# EasyEDA schematic SCH_Photon-Avatar-Headset_2024-04-25.json
TITLE: Headset; REV: 1.0; Date: 2024-Feb-26; Sheet: 1/1; Drawn By: Ганболд Энхболд; Company: Digital-People
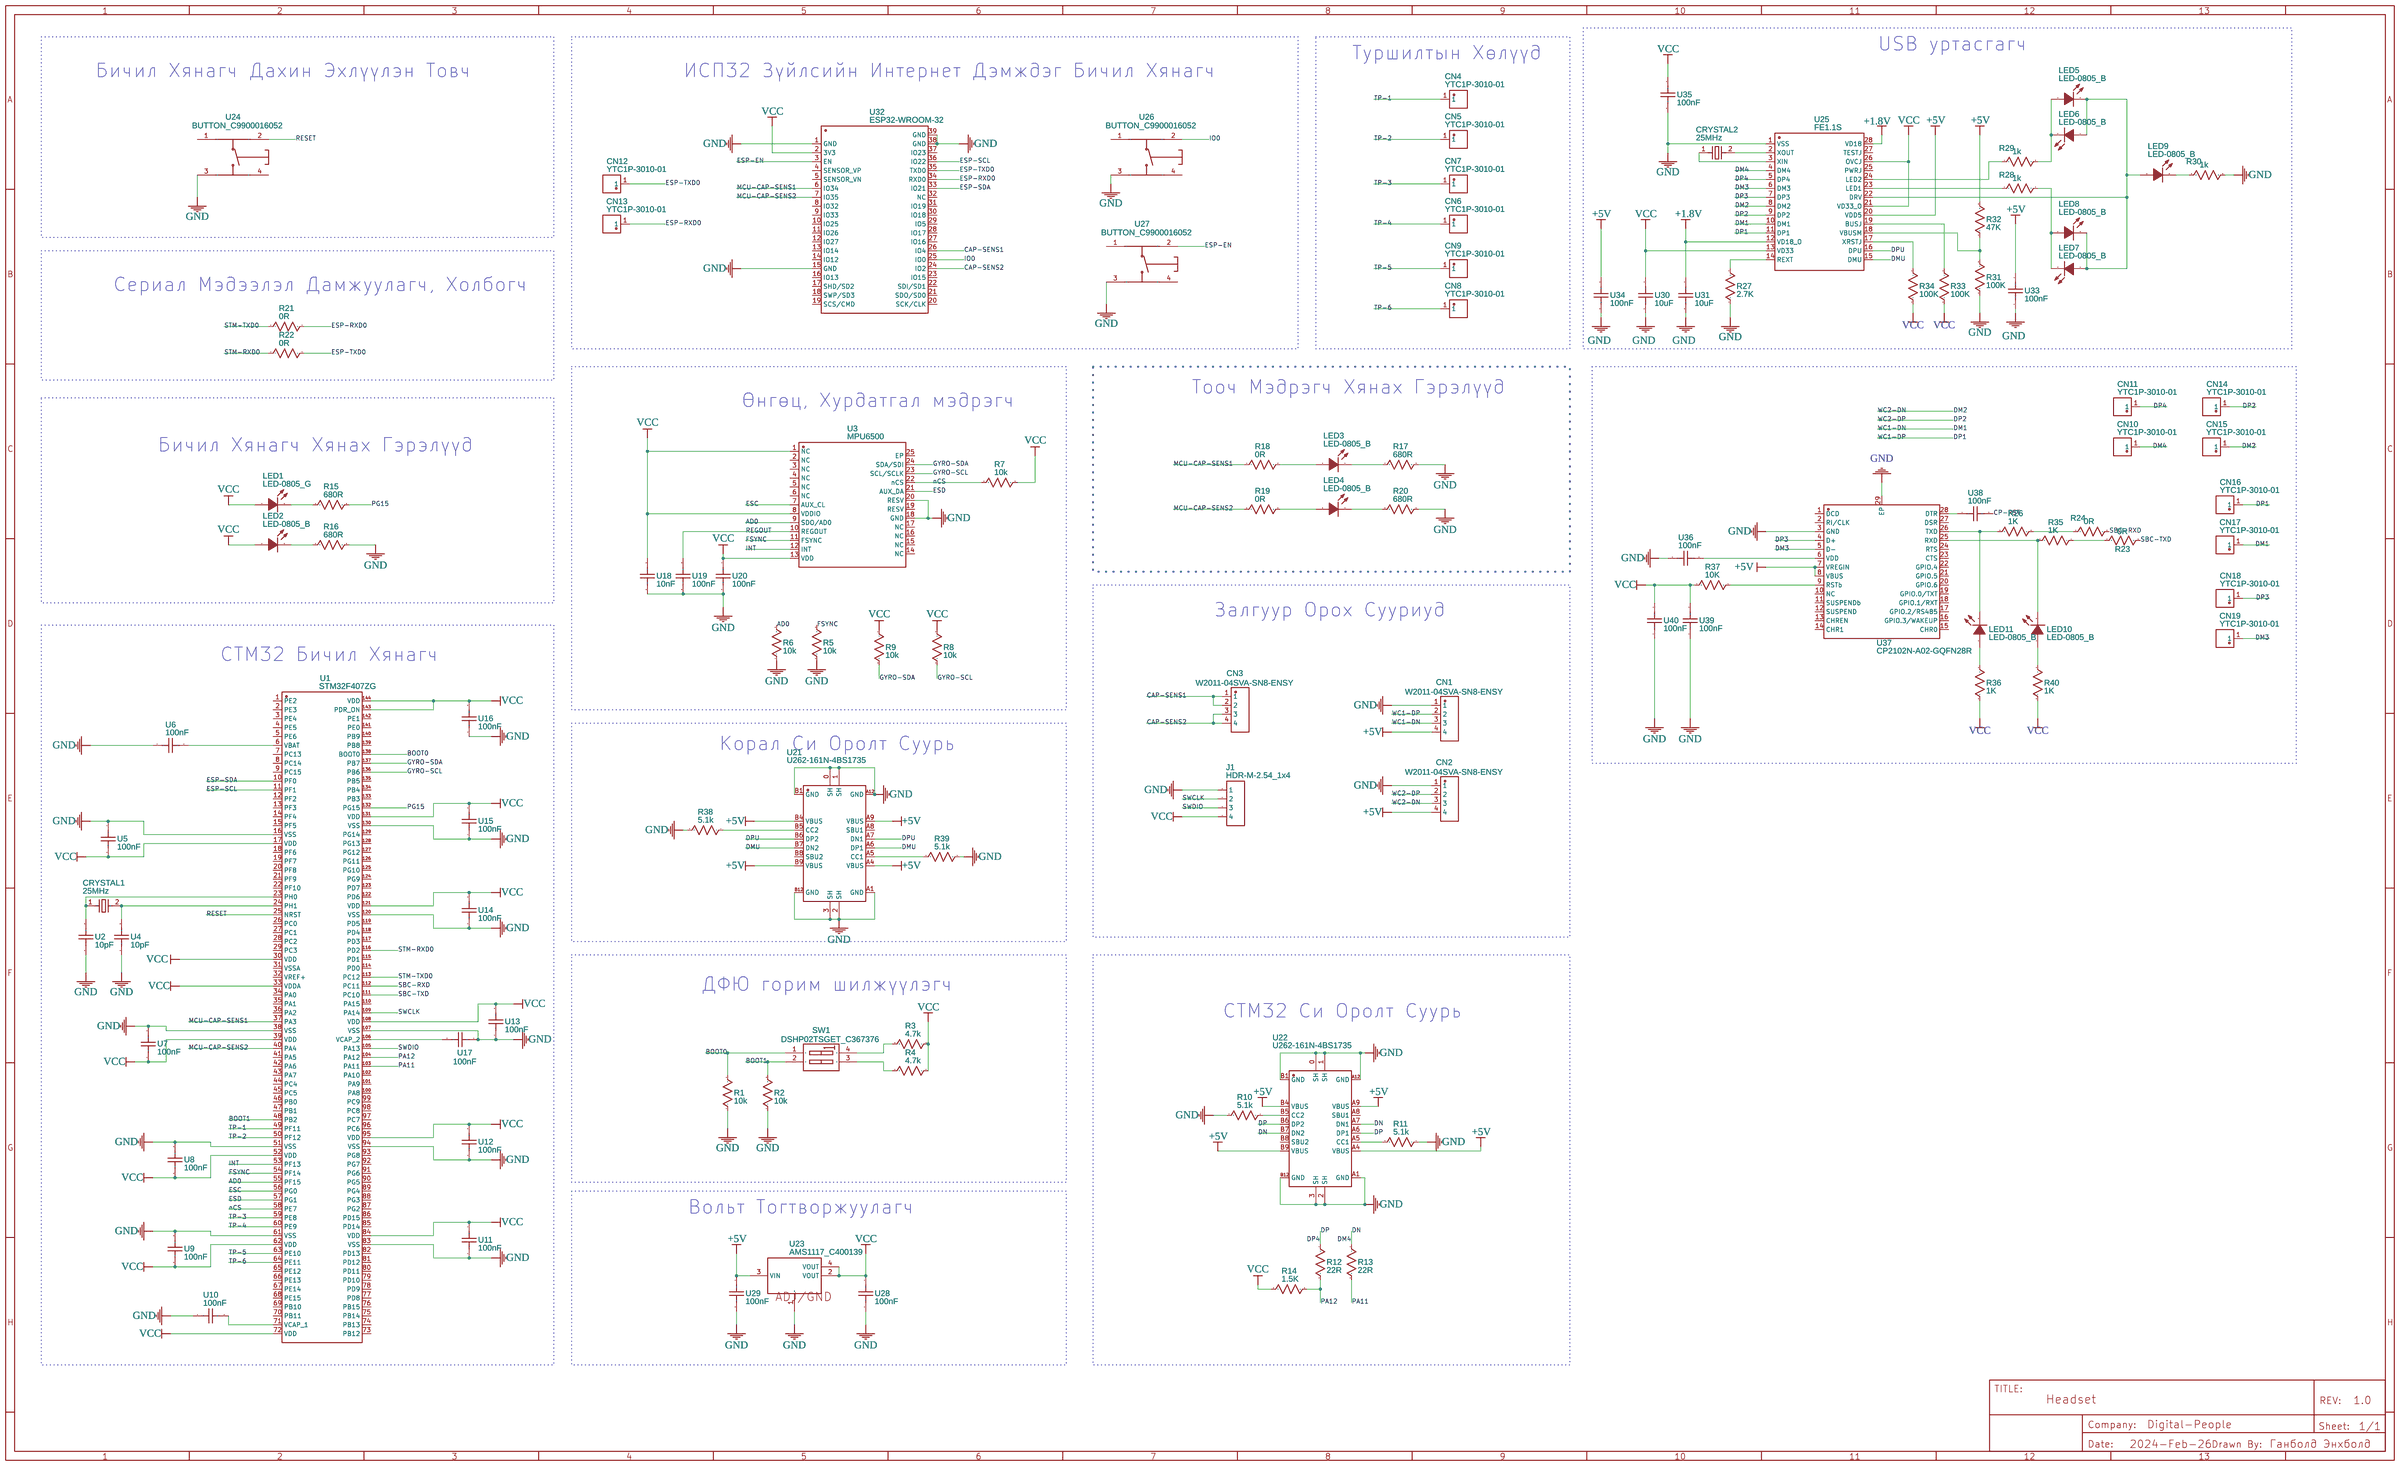
[diagram p0: schematic sheet]

## Parts
CN1  W2011-04SVA-SN8-ENSY  [CONN-TH-4P-P2.00_W2011-04SVA-SN8-ENSY]
CN2  W2011-04SVA-SN8-ENSY  [CONN-TH-4P-P2.00_W2011-04SVA-SN8-ENSY]
CN3  W2011-04SVA-SN8-ENSY  [CONN-TH-4P-P2.00_W2011-04SVA-SN8-ENSY]
CN4  YTC1P-3010-01  [TESTPOINT-SMD_BD2.0_C9900030651]
CN5  YTC1P-3010-01  [TESTPOINT-SMD_BD2.0_C9900030651]
CN6  YTC1P-3010-01  [TESTPOINT-SMD_BD2.0_C9900030651]
CN7  YTC1P-3010-01  [TESTPOINT-SMD_BD2.0_C9900030651]
CN8  YTC1P-3010-01  [TESTPOINT-SMD_BD2.0_C9900030651]
CN9  YTC1P-3010-01  [TESTPOINT-SMD_BD2.0_C9900030651]
CN10  YTC1P-3010-01  [TESTPOINT-SMD_BD2.0_C9900030651]
CN11  YTC1P-3010-01  [TESTPOINT-SMD_BD2.0_C9900030651]
CN12  YTC1P-3010-01  [TESTPOINT-SMD_BD2.0_C9900030651]
CN13  YTC1P-3010-01  [TESTPOINT-SMD_BD2.0_C9900030651]
CN14  YTC1P-3010-01  [TESTPOINT-SMD_BD2.0_C9900030651]
CN15  YTC1P-3010-01  [TESTPOINT-SMD_BD2.0_C9900030651]
CN16  YTC1P-3010-01  [TESTPOINT-SMD_BD2.0_C9900030651]
CN17  YTC1P-3010-01  [TESTPOINT-SMD_BD2.0_C9900030651]
CN18  YTC1P-3010-01  [TESTPOINT-SMD_BD2.0_C9900030651]
CN19  YTC1P-3010-01  [TESTPOINT-SMD_BD2.0_C9900030651]
CRYSTAL1  25MHz  [CRYSTAL-SMD_L11.4-W4.8-LS12.7]
CRYSTAL2  25MHz  [CRYSTAL-SMD_L11.4-W4.8-LS12.7]
J1  HDR-M-2.54_1x4  [HDR-M-2.54_1X4]
LED1  LED-0805_G  [LED0805_GREEN]
LED2  LED-0805_B  [LED0805_BLUE]
LED3  LED-0805_B  [LED0805_BLUE]
LED4  LED-0805_B  [LED0805_BLUE]
LED5  LED-0805_B  [LED0805_BLUE]
LED6  LED-0805_B  [LED0805_BLUE]
LED7  LED-0805_B  [LED0805_BLUE]
LED8  LED-0805_B  [LED0805_BLUE]
LED9  LED-0805_B  [LED0805_BLUE]
LED10  LED-0805_B  [LED0805_BLUE]
LED11  LED-0805_B  [LED0805_BLUE]
R1  10k  [R0805]
R2  10k  [R0805]
R3  4.7k  [R0805]
R4  4.7k  [R0805]
R5  10k  [R0805]
R6  10k  [R0805]
R7  10k  [R0805]
R8  10k  [R0805]
R9  10k  [R0805]
R10  5.1k  [R0805]
R11  5.1k  [R0805]
R12  22R  [R0805]
R13  22R  [R0805]
R14  1.5K  [R0805]
R15  680R  [R0805]
R16  680R  [R0805]
R17  680R  [R0805]
R18  0R  [R0603]
R19  0R  [R0603]
R20  680R  [R0805]
R21  0R  [R0603]
R22  0R  [R0603]
R23  0R  [R0603]
R24  0R  [R0603]
R26  1K  [R0805]
R27  2.7K  [R0805]
R28  1k  [R0805]
R29  1k  [R0805]
R30  1k  [R0805]
R31  100K  [R0805]
R32  47K  [R0805]
R33  100K  [R0805]
R34  100K  [R0805]
R35  1K  [R0805]
R36  1K  [R0805]
R37  10K  [R0805]
R38  5.1k  [R0805]
R39  5.1k  [R0805]
R40  1K  [R0805]
SW1  DSHP02TSGET_C367376  [SW-SMD_DSHP02TSGER]
U1  STM32F407ZG  [QFP-144_L20.0-W20.0-P0.50-LS22.0-BL]
U2  10pF  [C0805]
U3  MPU6500  [QFN-24_L3.0-W3.0-P0.40-BL-EP]
U4  10pF  [C0805]
U5  100nF  [C0805]
U6  100nF  [C0805]
U7  100nF  [C0805]
U8  100nF  [C0805]
U9  100nF  [C0805]
U10  100nF  [C0805]
U11  100nF  [C0805]
U12  100nF  [C0805]
U13  100nF  [C0805]
U14  100nF  [C0805]
U15  100nF  [C0805]
U16  100nF  [C0805]
U17  100nF  [C0805]
U18  10nF  [C0805]
U19  100nF  [C0805]
U20  100nF  [C0805]
U21  U262-161N-4BS1735  [USB-C-SMD_TYPE-C-16P-4BS1735]
U22  U262-161N-4BS1735  [USB-C-SMD_TYPE-C-16P-4BS1735]
U23  AMS1117_C400139  [SOT-223-3_L6.5-W3.4-P2.30-LS7.0-BR]
U24  BUTTON_C9900016052  [SW-SMD_4P-L5.1-W5.1-P3.70-LS6.5-TL-2]
U25  FE1.1S  [SSOP-28_L9.9-W3.9-P0.64-LS6.0-BL-1]
U26  BUTTON_C9900016052  [SW-SMD_4P-L5.1-W5.1-P3.70-LS6.5-TL-2]
U27  BUTTON_C9900016052  [SW-SMD_4P-L5.1-W5.1-P3.70-LS6.5-TL-2]
U28  100nF  [C0805]
U29  100nF  [C0805]
U30  10uF  [C0805]
U31  10uF  [C0805]
U32  ESP32-WROOM-32  [WIFIM-SMD_ESP32-WROOM-32-N4]
U33  100nF  [C0805]
U34  100nF  [C0805]
U35  100nF  [C0805]
U36  100nF  [C0805]
U37  CP2102N-A02-GQFN28R  [QFN-28_L5.0-W5.0-P0.50-TL-EP3.3]
U38  100nF  [C0805]
U39  100nF  [C0805]
U40  100nF  [C0805]

## Library data of the parts
CN1-CN3 = W2011-04SVA-SN8-ENSY: Contributor: lcsc; Supplier: LCSC; Supplier Part: C9900022692; Manufacturer: null
CN4-CN19 = YTC1P-3010-01: Supplier: LCSC; Supplier Part: C5221282; Manufacturer: YIYUAN(怡远); JLCPCB Part Class: Extended Part; Contributor: lcsc
CRYSTAL1 CRYSTAL2 = SD2012M00020001: Supplier: LCSC; Supplier Part: C7294737; Manufacturer: HUAXIN(华昕); Contributor: lcsc
J1 = HDR-M-2.54_1x4: Supplier Part: C124378; Supplier: LCSC; Contributor: LCEDA_Lib
LED1 = LED-0805_G: Manufacturer: 国星光电; Manufacturer Part: NCD0805G1; Supplier Part: C84260; Contributor: LCEDA_Lib
LED2-LED11 = LED-0805_B: Manufacturer: 方舟 ARKLED; Manufacturer Part: D-B080508B1-KS2; Supplier Part: C108412; Contributor: LCEDA_Lib
R1-R24 R26-R40 = R_0805_US: Contributor: LCEDA_Lib
SW1 = DSHP02TSGET_C367376: Contributor: LCSC; Supplier: LCSC; Supplier Part: C367376; Manufacturer: YE; Manufacturer Part: DSHP02TSGER; JLCPCB Part Class: Extended Part
U1 = STM32F407ZG: Contributor: LCSC; Supplier: LCSC; Supplier Part: C9900009842; Manufacturer: null; JLCPCB Part Class: Extended Part
U2 U4-U20 U28-U31 U33-U36 U38-U40 = 0805N220J500CT-C: Contributor: lcsc; Supplier: LCSC; Supplier Part: C2991347; Manufacturer: Walsin(华新科)
U3 = MPU6500: Supplier: LCSC; Manufacturer: TDK InvenSense(应美盛); Manufacturer Part: MPU-6500; Supplier Part: C50278; JLCPCB Part Class: Extended Part
U21 U22 = U262-161N-4BS1735: Contributor: lcsc; Supplier: LCSC; Supplier Part: C2879828; Manufacturer: XKB Connectivity(中国星坤); JLCPCB Part Class: Extended Part
U23 = AMS1117_C400139: Contributor: LCSC; Supplier: LCSC; Supplier Part: C400139; Manufacturer: UNI-SEMI(宇力半导体); Manufacturer Part: AMS1117-T33; JLCPCB Part Class: Extended Part
U24 U26 U27 = BUTTON_C9900016052: Contributor: lcsc; Supplier: LCSC; Supplier Part: C9900016052; Manufacturer: null; Manufacturer Part: button; JLCPCB Part Class: Extended Part
U25 = FE1.1S: Supplier: LCSC; Manufacturer: TERMINUS; Manufacturer Part: FE1.1S-BSOP28BCN; Supplier Part: C9359; JLCPCB Part Class: Extended Part
U32 = ESP32-WROOM-32: Contributor: LCSC; Supplier: LCSC; Supplier Part: C82899; Manufacturer: ESPRESSIF(乐鑫); Manufacturer Part: ESP32-WROOM-32-N4; JLCPCB Part Class: Extended Part
U37 = CP2102N-A02-GQFN28R: Contributor: LCSC; Supplier: LCSC; Supplier Part: C964632; Manufacturer: SKYWORKS/SILICON LABS(芯科); JLCPCB Part Class: Extended Part

## Nets
+1.8V: U25.12(VD18_O) U25.28(VD18) U31.1
+5V: CN1.4 CN2.4 R32.2 U21.A4(VBUS) U21.A9(VBUS) U21.B4(VBUS) U21.B9(VBUS) U22.A4(VBUS) U22.A9(VBUS) U22.B4(VBUS) U22.B9(VBUS) U23.3(VIN) U25.20(VDD5) U29.1 U33.1 U34.1 U37.7(VREGIN) U37.8(VBUS)
GND: CN1.1 CN2.1 J1.1 R1.1 R2.1 R5.1 R6.1 R10.2 R11.1 R16.2 R17.2 R20.2 R27.1 R30.2 R31.1 R38.2 R39.1 U1.16(VSS) U1.38(VSS) U1.51(VSS) U1.61(VSS) U1.83(VSS) U1.94(VSS) U1.107(VSS) U1.120(VSS) U1.130(VSS) U2.1 U3.18(GND) U3.20(RESV) U4.1 U5.1 U6.1 U7.1 U8.1 U9.1 U10.1 U11.1 U12.1 U13.1 U14.1 U15.1 U16.1 U17.1 U18.2 U19.2 U20.2 U21.0(SH) U21.1(SH) U21.2(SH) U21.3(SH) U21.A1(GND) U21.A12(GND) U21.B1(GND) U21.B12(GND) U22.0(SH) U22.1(SH) U22.2(SH) U22.3(SH) U22.A1(GND) U22.A12(GND) U22.B1(GND) U22.B12(GND) U23.1(ADJ/GND) U24.3 U25.1(VSS) U26.3 U27.3 U28.2 U29.2 U30.2 U31.2 U32.1(GND) U32.15(GND) U32.38(GND) U32.39(GND) U33.2 U34.2 U35.2 U36.1 U37.3(GND) U37.29(EP) U39.1 U40.1
VCC: J1.4 LED1.1 LED2.1 R3.1 R4.1 R7.1 R8.1 R9.1 R14.1 R33.2 R34.2 R36.1 R37.2 R40.1 U1.17(VDD) U1.30(VDD) U1.33(VDDA) U1.39(VDD) U1.52(VDD) U1.62(VDD) U1.72(VDD) U1.84(VDD) U1.95(VDD) U1.108(VDD) U1.121(VDD) U1.131(VDD) U1.143(PDR_ON) U1.144(VDD) U3.1(NC) U3.8(VDDIO) U3.13(VDD) U5.2 U7.2 U8.2 U9.2 U11.2 U12.2 U13.2 U14.2 U15.2 U16.2 U18.1 U20.1 U23.2(VOUT) U23.4(VOUT) U25.13(VD33) U25.21(VD33_O) U25.26(OVCJ) U28.1 U30.1 U32.2(3V3) U35.1 U39.2 U40.2
AD0: R6.2 U1.55(PF15) U3.9(SDO/AD0)
BOOT0: R1.2 SW1.1(A1) U1.138(BOOT0)
BOOT1: R2.2 SW1.2(A2) U1.48(PB2)
CAP-SENS1: CN3.1 CN3.2 U32.26(IO4)
CAP-SENS2: CN3.3 CN3.4 U32.24(IO2)
CP-RST: U38.2
DM1: CN1.3 CN17.1 U25.10(DM1)
DM2: CN2.3 CN15.1 U25.8(DM2)
DM3: CN19.1 U25.6(DM3) U37.5(D-)
DM4: CN10.1 R13.1 U22.A7(DN1) U22.B7(DN2) U25.4(DM4)
DMU: U21.A6(DP1) U21.B7(DN2) U25.15(DMU)
DP: CN11.1 R12.1 U22.A6(DP1) U22.B6(DP2) U25.5(DP4)
DP1: CN1.2 CN16.1 U25.11(DP1)
DP2: CN2.2 CN14.1 U25.9(DP2)
DP3: CN18.1 U25.7(DP3) U37.4(D+)
DPU: U21.A7(DN1) U21.B6(DP2) U25.16(DPU)
ESC: U1.56(PG0) U3.7(AUX_CL)
ESD: U1.57(PG1) U3.21(AUX_DA)
ESP-EN: U27.2 U32.3(EN)
ESP-RXD0: CN13.1 R21.2 U32.34(RXD0)
ESP-SCL: U1.11(PF1) U32.36(IO22)
ESP-SDA: U1.10(PF0) U32.33(IO21)
ESP-TXD0: CN12.1 R22.2 U32.35(TXD0)
FSYNC: R5.2 U1.54(PF14) U3.11(FSYNC)
GYRO-SCL: R8.2 U1.136(PB6) U3.23(SCL/SCLK)
GYRO-SDA: R9.2 U1.137(PB7) U3.24(SDA/SDI)
INT: U1.53(PF13) U3.12(INT)
IO0: U26.2 U32.25(IO0)
MCU-CAP-SENS1: R18.1 U1.37(PA3) U32.6(IO34)
MCU-CAP-SENS2: R19.1 U1.40(PA4) U32.7(IO35)
nCS: R7.2 U1.58(PE7) U3.22(nCS)
PA11: R13.2 U1.103(PA11)
PA12: R12.2 R14.2 U1.104(PA12)
PG15: R15.2 U1.132(PG15)
REGOUT: U3.10(REGOUT) U19.1
RESET: U1.25(NRST) U24.2
SBC-RXD: R24.2 U1.112(PC11)
SBC-TXD: R23.2 U1.111(PC10)
STM-RXD0: R22.1 U1.116(PD2)
STM-TXD0: R21.1 U1.113(PC12)
SWCLK: J1.2 U1.109(PA14)
SWDIO: J1.3 U1.105(PA13)
TP-1: CN4.1 U1.49(PF11)
TP-2: CN5.1 U1.50(PF12)
TP-3: CN7.1 U1.59(PE8)
TP-4: CN6.1 U1.60(PE9)
TP-5: CN9.1 U1.63(PE10)
TP-6: CN8.1 U1.64(PE11)
Net-(CRYSTAL1-1): CRYSTAL1.1 U1.23(PH0) U2.2
Net-(CRYSTAL1-2): CRYSTAL1.2 U1.24(PH1) U4.2
Net-(CRYSTAL2-1): CRYSTAL2.1 U25.3(XIN)
Net-(CRYSTAL2-2): CRYSTAL2.2 U25.2(XOUT)
Net-(LED1-2): LED1.2 R15.1
Net-(LED2-2): LED2.2 R16.1
Net-(LED3-1): LED3.1 R18.2
Net-(LED3-2): LED3.2 R17.1
Net-(LED4-1): LED4.1 R19.2
Net-(LED4-2): LED4.2 R20.1
Net-(LED5-1): LED5.1 LED6.2 R29.2
Net-(LED5-2): LED5.2 LED6.1 LED7.1 LED8.2 LED9.1 U25.22(DRV)
Net-(LED7-2): LED7.2 LED8.1 R28.2
Net-(LED9-2): LED9.2 R30.1
Net-(LED10-1): LED10.1 R40.2
Net-(LED10-2): LED10.2 R35.2 U37.25(RXD)
Net-(LED11-1): LED11.1 R36.2
Net-(LED11-2): LED11.2 R26.2 U37.26(TXD)
Net-(R3-2): R3.2 SW1.4(B1)
Net-(R4-2): R4.2 SW1.3(B2)
Net-(R10-1): R10.1 U22.B5(CC2)
Net-(R11-2): R11.2 U22.A5(CC1)
Net-(R23-1): R23.1 R35.1
Net-(R24-1): R24.1 R26.1
Net-(R27-2): R27.2 U25.14(REXT)
Net-(R28-1): R28.1 U25.23(LED1)
Net-(R29-1): R29.1 U25.24(LED2)
Net-(R31-2): R31.2 R32.1 U25.18(VBUSM)
Net-(R33-1): R33.1 U25.19(BUSJ)
Net-(R34-1): R34.1 U25.17(XRSTJ)
Net-(R37-1): R37.1 U37.9(RSTb)
Net-(R38-1): R38.1 U21.B5(CC2)
Net-(R39-2): R39.2 U21.A5(CC1)
Net-(U1-6): U1.6(VBAT) U6.2
Net-(U1-71): U1.71(VCAP_1) U10.2
Net-(U1-106): U1.106(VCAP_2) U17.2
Net-(U36-2): U36.2 U37.6(VDD)
Net-(U37-28): U37.28(DTR) U38.1

Not connected (* = marked no-connect by the designer): U1 1(PE2) 2(PE3) 3(PE4) 4(PE5) 5(PE6) 7(PC13) 8(PC14) 9(PC15) 12(PF2) 13(PF3) 14(PF4) 15(PF5) 18(PF6) 19(PF7) 20(PF8) 21(PF9) 22(PF10) 26(PC0) 27(PC1) 28(PC2) 29(PC3) 31(VSSA) 32(VREF+) 34(PA0) 35(PA1) 36(PA2) 41(PA5) 42(PA6) 43(PA7) 44(PC4) 45(PC5) 46(PB0) 47(PB1) 65(PE12) 66(PE13) 67(PE14) 68(PE15) 69(PB10) 70(PB11) 73(PB12) 74(PB13) 75(PB14) 76(PB15) 77(PD8) 78(PD9) 79(PD10) 80(PD11) 81(PD12) 82(PD13) 85(PD14) 86(PD15) 87(PG2) 88(PG3) 89(PG4) 90(PG5) 91(PG6) 92(PG7) 93(PG8) 96(PC6) 97(PC7) 98(PC8) 99(PC9) 100(PA8) 101(PA9) 102(PA10) 110(PA15) 114(PD0) 115(PD1) 117(PD3) 118(PD4) 119(PD5) 122(PD6) 123(PD7) 124(PG9) 125(PG10) 126(PG11) 127(PG12) 128(PG13) 129(PG14) 133(PB3) 134(PB4) 135(PB5) 139(PB8) 140(PB9) 141(PE0) 142(PE1); U3 2(NC) 3(NC) 4(NC) 5(NC) 6(NC) 14(NC) 15(NC) 16(NC) 17(NC) 19(RESV) 25(EP); U21 A8(SBU1) B8(SBU2); U22 A8(SBU1) B8(SBU2); U24 1 4; U25 25(PWRJ) 27(TESTJ); U26 1 4; U27 1 4; U32 4(SENSOR_VP) 5(SENSOR_VN) 8(IO32) 9(IO33) 10(IO25) 11(IO26) 12(IO27) 13(IO14) 14(IO12) 16(IO13) 17(SHD/SD2) 18(SWP/SD3) 19(SCS/CMD) 20(SCK/CLK) 21(SDO/SD0) 22(SDI/SD1) 23(IO15) 27(IO16) 28(IO17) 29(IO5) 30(IO18) 31(IO19) 32(NC) 37(IO23); U37 1(DCD) 2(RI/CLK) 10(NC) 11(SUSPENDb) 12(SUSPEND) 13(CHREN) 14(CHR1) 15(CHR0) 16(GPIO.3/WAKEUP) 17(GPIO.2/RS485) 18(GPIO.1/RXT) 19(GPIO.0/TXT) 20(GPIO.6) 21(GPIO.5) 22(GPIO.4) 23(CTS) 24(RTS) 27(DSR)

## Notes on the sheet
- USB уртасгагч
- Туршилтын Хөлүүд
- Бичил Хянагч Дахин Эхлүүлэн Товч
- ИСП32 Зүйлсийн Интернет Дэмждэг Бичил Хянагч
- Сериал Мэдээлэл Дамжуулагч, Холбогч
- Тооч Мэдрэгч Хянах Гэрэлүүд
- Өнгөц, Хурдатгал мэдрэгч
- Бичил Хянагч Хянах Гэрэлүүд
- Залгуур Орох Сууриуд
- СТМ32 Бичил Хянагч
- Корал Си Оролт Суурь
- ДФЮ горим шилжүүлэгч
- СТМ32 Си Оролт Суурь
- Вольт Тогтворжуулагч
